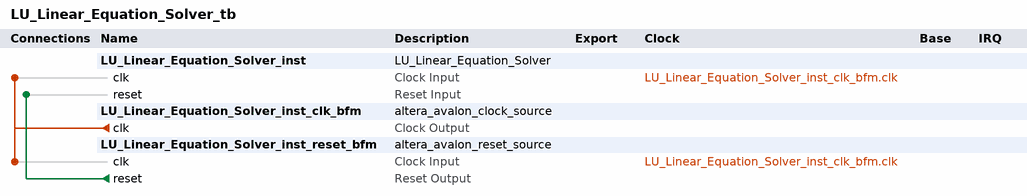
[diagram p0: system contents]
# Platform Designer (Qsys) system LU_Linear_Equation_Solver_tb, Cyclone IV E EP4CE22F17C6
# Parameters at their usual value, and those the tool derives, are not listed.
package require -exact qsys 18.1
create_system LU_Linear_Equation_Solver_tb
set_project_property DEVICE_FAMILY {Cyclone IV E}
set_project_property DEVICE EP4CE22F17C6

add_instance LU_Linear_Equation_Solver_inst LU_Linear_Equation_Solver 1.0

add_instance LU_Linear_Equation_Solver_inst_clk_bfm altera_avalon_clock_source 18.1

add_instance LU_Linear_Equation_Solver_inst_reset_bfm altera_avalon_reset_source 18.1
set_instance_parameter_value LU_Linear_Equation_Solver_inst_reset_bfm ASSERT_HIGH_RESET 0
set_instance_parameter_value LU_Linear_Equation_Solver_inst_reset_bfm INITIAL_RESET_CYCLES 50

# connections
add_connection LU_Linear_Equation_Solver_inst_clk_bfm.clk LU_Linear_Equation_Solver_inst.clk clock
add_connection LU_Linear_Equation_Solver_inst_clk_bfm.clk LU_Linear_Equation_Solver_inst_reset_bfm.clk clock
add_connection LU_Linear_Equation_Solver_inst_reset_bfm.reset LU_Linear_Equation_Solver_inst.reset reset

set_interconnect_requirement {$system} qsys_mm.clockCrossingAdapter HANDSHAKE
set_interconnect_requirement {$system} qsys_mm.enableEccProtection FALSE
set_interconnect_requirement {$system} qsys_mm.insertDefaultSlave FALSE
set_interconnect_requirement {$system} qsys_mm.maxAdditionalLatency 1

save_system LU_Linear_Equation_Solver_tb.qsys
